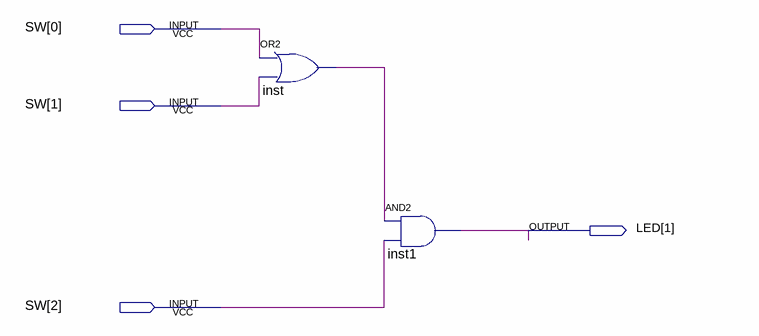
[diagram p0: schematic sheet]
// Quartus schematic ex2.bdf as structural Verilog: 2 symbols, 4 pins
module ex2 (
  input  [2:0] SW,
  output [1:1] LED
);

  wire inst_out;

  or inst (inst_out, SW[0], SW[1]);
  and inst1 (LED[1], inst_out, SW[2]);
endmodule
